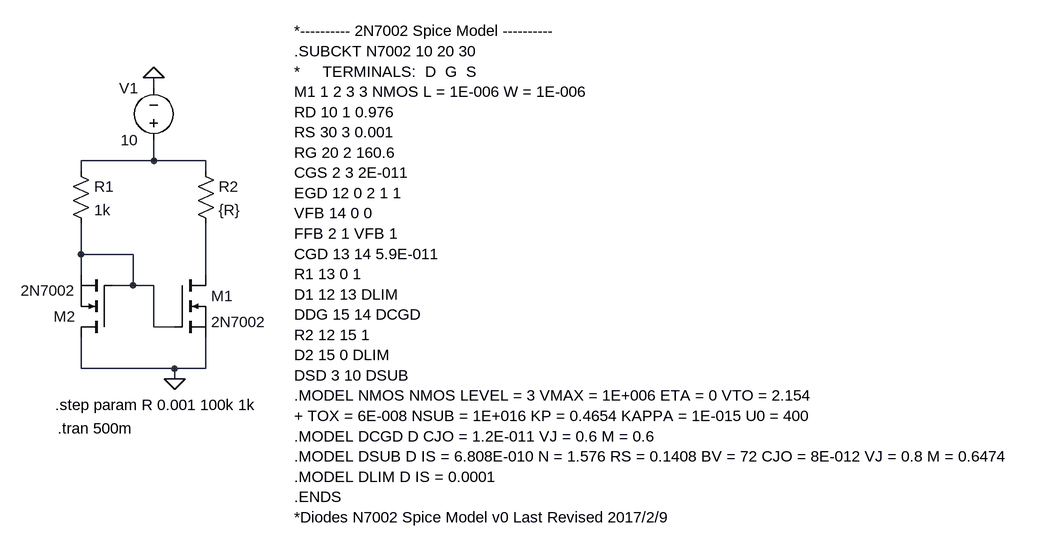
[diagram p0: schematic Draft3.asc]
Draft3.asc, the LTspice schematic file:
Version 4
SHEET 1 1696 700
WIRE 304 80 304 64
WIRE 304 192 304 160
WIRE 304 192 192 192
WIRE 384 192 304 192
WIRE 192 208 192 192
WIRE 384 208 384 192
WIRE 192 336 192 288
WIRE 272 336 192 336
WIRE 192 368 192 336
WIRE 384 368 384 288
WIRE 272 384 272 336
WIRE 272 384 240 384
WIRE 304 384 272 384
WIRE 304 448 304 384
WIRE 336 448 304 448
WIRE 192 512 192 464
WIRE 336 512 192 512
WIRE 384 512 384 464
WIRE 384 512 336 512
WIRE 336 528 336 512
FLAG 304 64 0
FLAG 336 528 0
SYMBOL voltage 304 176 R180
WINDOW 0 24 96 Left 2
WINDOW 3 24 16 Left 2
WINDOW 123 0 0 Left 0
WINDOW 39 0 0 Left 0
SYMATTR InstName V1
SYMATTR Value 10
SYMBOL res 176 192 R0
SYMATTR InstName R1
SYMATTR Value 1k
SYMBOL res 368 192 R0
SYMATTR InstName R2
SYMATTR Value {R}
SYMBOL nmos 336 368 R0
SYMATTR InstName M1
SYMATTR Value 2N7002
SYMBOL nmos 240 464 R180
SYMATTR InstName M2
SYMATTR Value 2N7002
TEXT 520 -8 Left 2 !*---------- 2N7002 Spice Model ----------\n.SUBCKT N7002 10 20 30 \n*     TERMINALS:  D  G  S\nM1 1 2 3 3 NMOS L = 1E-006 W = 1E-006 \nRD 10 1 0.976 \nRS 30 3 0.001 \nRG 20 2 160.6 \nCGS 2 3 2E-011 \nEGD 12 0 2 1 1 \nVFB 14 0 0 \nFFB 2 1 VFB 1 \nCGD 13 14 5.9E-011 \nR1 13 0 1 \nD1 12 13 DLIM \nDDG 15 14 DCGD \nR2 12 15 1 \nD2 15 0 DLIM \nDSD 3 10 DSUB \n.MODEL NMOS NMOS LEVEL = 3 VMAX = 1E+006 ETA = 0 VTO = 2.154 \n+ TOX = 6E-008 NSUB = 1E+016 KP = 0.4654 KAPPA = 1E-015 U0 = 400 \n.MODEL DCGD D CJO = 1.2E-011 VJ = 0.6 M = 0.6 \n.MODEL DSUB D IS = 6.808E-010 N = 1.576 RS = 0.1408 BV = 72 CJO = 8E-012 VJ = 0.8 M = 0.6474 \n.MODEL DLIM D IS = 0.0001 \n.ENDS\n*Diodes N7002 Spice Model v0 Last Revised 2017/2/9
TEXT 152 568 Left 2 !.step param R 0.001 100k 1k
TEXT 156 604 Left 2 !.tran 500m

The netlist it stands for:
* Draft3.asc
V1 N001 0 10
R1 N001 N002 1k
R2 N001 N003 {R}
M1 N003 N002 0 0 2N7002
M2 0 N002 N002 N002 2N7002
.model NMOS NMOS
.model PMOS PMOS
.lib standard.mos
*---------- 2N7002 Spice Model ----------
.SUBCKT N7002 10 20 30
*     TERMINALS:  D  G  S
M1 1 2 3 3 NMOS L = 1E-006 W = 1E-006
RD 10 1 0.976
RS 30 3 0.001
RG 20 2 160.6
CGS 2 3 2E-011
EGD 12 0 2 1 1
VFB 14 0 0
FFB 2 1 VFB 1
CGD 13 14 5.9E-011
R1 13 0 1
D1 12 13 DLIM
DDG 15 14 DCGD
R2 12 15 1
D2 15 0 DLIM
DSD 3 10 DSUB
.MODEL NMOS NMOS LEVEL = 3 VMAX = 1E+006 ETA = 0 VTO = 2.154
+ TOX = 6E-008 NSUB = 1E+016 KP = 0.4654 KAPPA = 1E-015 U0 = 400
.MODEL DCGD D CJO = 1.2E-011 VJ = 0.6 M = 0.6
.MODEL DSUB D IS = 6.808E-010 N = 1.576 RS = 0.1408 BV = 72 CJO = 8E-012 VJ = 0.8 M = 0.6474
.MODEL DLIM D IS = 0.0001
.ENDS
*Diodes N7002 Spice Model v0 Last Revised 2017/2/9
.step param R 0.001 100k 1k
.tran 500m
.backanno
.end